# Altium schematic sheet karmanDB_power&pyro.SchDoc
size A
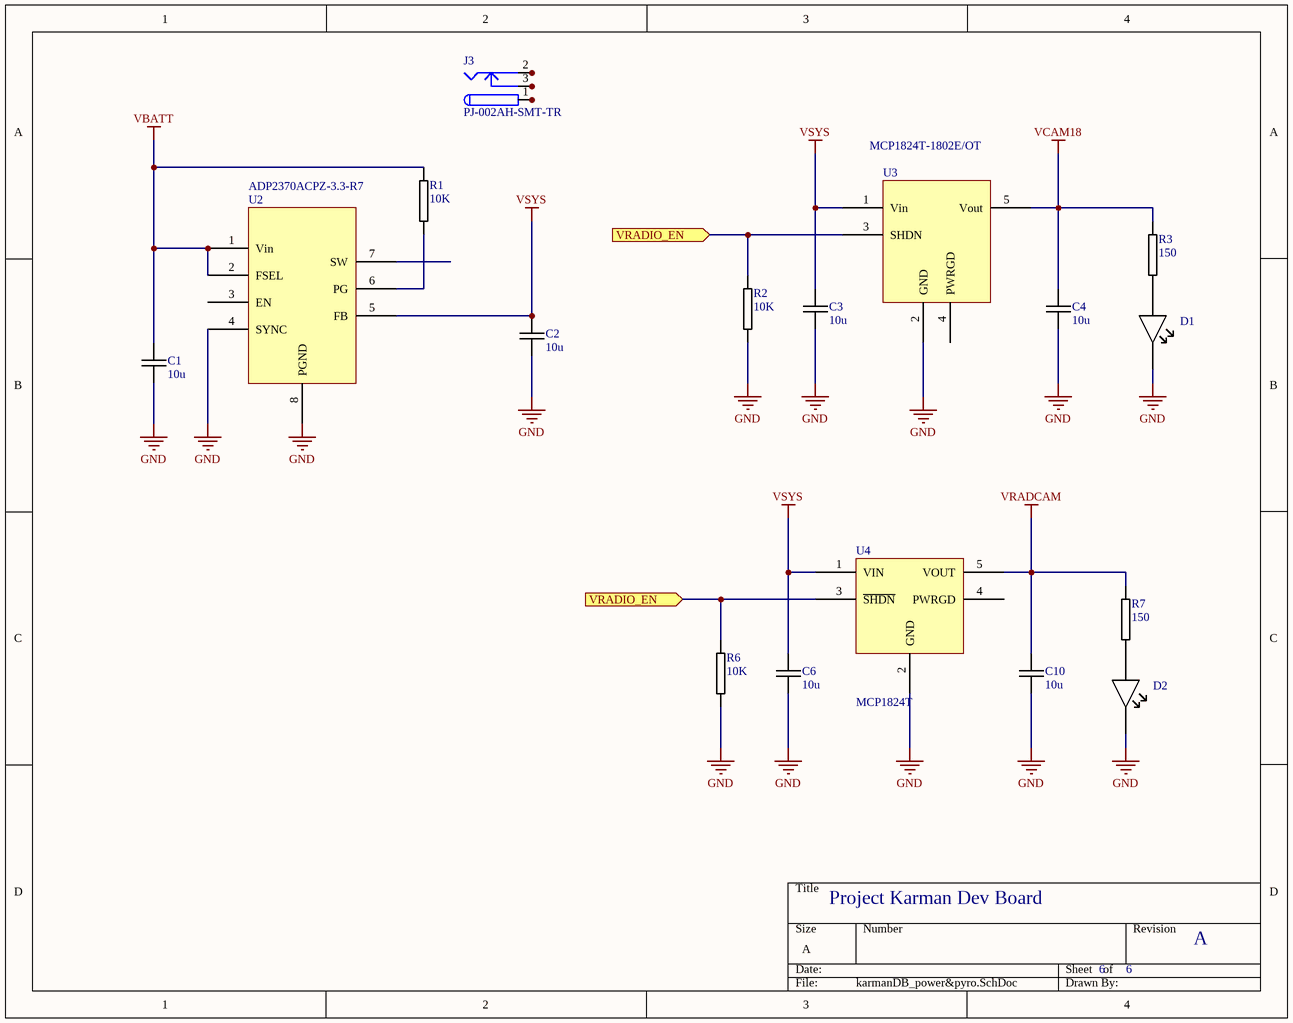
[diagram p0: karmanDB_power&pyro.SchDoc]

## Parts
C1  10u  [MURATA_GRM_0603]
C2  10u  [MURATA_GRM_0603]
C3  10u  [MURATA_GRM_0603]
C4  10u  [MURATA_GRM_0603]
C6  10u  [MURATA_GRM_0603]
C10  10u  [MURATA_GRM_0603]
D1  LED_LITEON_LTST-C150CKT  [LITEON_LTST-C150]  (value not drawn)
D2  LED_LITEON_LTST-C150CKT  [LITEON_LTST-C150]  (value not drawn)
J3  PJ-002AH-SMT-TR
R1  10K  [MURATA_GRM_0603]
R2  10K  [MURATA_GRM_0603]
R3  150  [PANASONIC_ERJ3R]
R6  10K  [MURATA_GRM_0603]
R7  150  [PANASONIC_ERJ3R]
U2  ADP2370ACPZ-3.3-R7
U3  MCP1824T-1802E/OT
U4  MCP1824T  [MICROCHIP_MCP1824/OE]

## Ports
VRADIO_EN (in)

## Nets
GND: C1.2 C2.2 C3.2 C4.2 C6.2 C10.2 D1.K D2.K R2.2 R6.2 U2.4(SYNC) U2.8(PGND) U3.2(GND) U4.2(GND)
VBATT: C1.1 R1.1 U2.1(Vin) U2.2(FSEL)
VCAM18: C4.1 R3.1 U3.5(Vout)
VRADCAM: C10.1 R7.1 U4.5(VOUT)
VSYS: C2.1 C3.1 C6.1 U2.5(FB) U3.1(Vin) U4.1(VIN)
VRADIO_EN: R2.1 R6.1 U3.3(SHDN) U4.3(~{SHDN}) ; port VRADIO_EN
NetD1_A: D1.A R3.2
NetD2_A: D2.A R7.2
NetJ3_1: J3.1 J3.1A J3.1B
NetJ3_2: J3.2 J3.2A J3.2B
NetJ3_3: J3.3 J3.3A J3.3B
NetR1_2: R1.2 U2.6(PG)

Not connected (* = marked no-connect by the designer): U2 3(EN) 7(SW); U3 4(PWRGD); U4 4(PWRGD)

## Notes on the sheet
- Project Karman Dev Board
- 6
- A

## Library data of the parts
C1-C4 C6 C10 = CAP_MURATA_GRM188R60J106: CAP CER 10UF 6.3V 20% X5R 0603; Manufacturer: Murata Electronics North America; Manufacturer Part Number: GRM188R60J106ME47J; Capacitance: 10µF; Supplier 1: Digi-Key; Supplier Part Number 1: 490-6405-1-ND; RoHS: RoHS Compliant; Category: Capacitors; Stock 1: 159118; Pricing: 1=0.19, 10=0.128, 50=0.0776, 100=0.0651, 250=0.05272, 500=0.0465, 1000=0.03953, 5000=0.03333 (USD); Packaging: Cut Tape (CT); Tolerance: ±20%; Voltage - Rated: 6.3V; Temperature Coefficient: X5R; Mounting Type: Surface Mount, MLCC; Operating Temperature: -55°C ~ 85°C; Applications: General Purpose; Ratings: -; Package / Case: 0603 (1608 Metric); Size / Dimension: 0.063" L x 0.031" W (1.60mm x 0.80mm); Height - Seated (Max): -; Thickness (Max): 0.035" (0.90mm); Lead Spacing: -; Features: -; Lead Style: -; ComponentLink1URL: http://www.murata.com/~/media/webrenewal/support/library/catalog/products/capacitor/mlcc/c02e.ashx; ComponentLink1Description: http://www.murata.com/~/media/webrenewal/support/library/catalog/products/capacitor/mlcc/c02e.ashx
D1 D2 = LED_LITEON_LTST-C150CKT: LED RED CLEAR 1206 SMD; Manufacturer: Lite-On Inc; Wavelength - Dominant: 638nm; Wavelength - Peak: 660nm; Millicandela Rating: 10mcd; Voltage - Forward (Vf) (Typ): 1.8V; Current - Test: 10mA; Viewing Angle: 130°; Lens Color: Colorless; Lens Style/Size: Rectangle with Flat Top, 2.06mm x 1.60mm; Supplier 1: Digi-Key; Supplier Part Number 1: 160-1167-1-ND; Manufacturer Part Number: LTST-C150CKT; RoHS: RoHS Compliant; Category: Optoelectronics; Stock 1: 90600; Pricing: 1=0.4, 10=0.297, 100=0.1574, 250=0.11136, 500=0.09504, 1000=0.07425 (USD); Packaging: Cut Tape (CT); Color: Red; Lens Transparency: Clear; Package / Case: 1206 (3216 Metric); Supplier Device Package: 1206; Size / Dimension: 3.20mm L x 1.60mm W; Height (Max): 1.10mm; Mounting Type: Surface Mount; ComponentLink1URL: http://optoelectronics.liteon.com/upload/download/DS-22-98-0002/S_110_LTST-C150CKT.pdf; ComponentLink1Description: http://optoelectronics.liteon.com/upload/download/DS-22-98-0002/S_110_LTST-C150CKT.pdf
J3 = PJ-002AH-SMT-TR: CONN POWER JACK 2.1X5.5MM HI CUR; Manufacturer: CUI Inc.; Gender: Male; Plug/Mating Plug Diameter: 2.1mm ID, 5.5mm OD; Number of Positions/Contacts: 2 Conductors, 3 Contacts; Internal Switch(s): Single Switch, Normally Closed; Shielding: Unshielded; Voltage - Rated: 24VDC; Current Rating: 5A; Supplier 1: Digi-Key; Manufacturer Part Number: PJ-002AH-SMT-TR; RoHS: RoHS Compliant; Category: Connectors, Interconnects; Stock 1: 15720; Pricing 1: 1=1.89, 10=1.469, 100=1.121 (USD); Connector Type: Jack; Mounting Type: Surface Mount; Termination: Solder; Features: -; Color: Black; Contact Material: Copper Alloy; Contact Material - Plating: Nickel; Housing Color: Black; Housing Material: Thermoplastic; Operating Temperature: -25°C ~ 85°C; ComponentLink1URL: http://www.cui.com/product/resource/digikeypdf/pj-002ah-smt.pdf; ComponentLink1Description: http://www.cui.com/product/resource/digikeypdf/pj-002ah-smt.pdf; Supplier Part Number 1: CP-002AHPJCT-ND
R1 R2 R6 = RES_PANASONIC_ERJ-3GEYJ103V: RES SMD 10K OHM 5% 1/10W 0603; Manufacturer: Panasonic Electronic Components; Power (Watts): 0.1W, 1/10W; Temperature Coefficient: ±200ppm/°C; Supplier 1: Digi-Key; Supplier Part Number 1: P10KGCT-ND; Manufacturer Part Number: ERJ-3GEYJ103V; RoHS: RoHS Compliant; Category: Resistors; Stock 1: 4229597; Pricing: 1=0.1, 50=0.0096, 100=0.0071, 250=0.00544, 500=0.00436, 1000=0.00321 (USD); Packaging: Cut Tape (CT); Resistance (Ohms): 10k; Tolerance: ±5%; Composition: Thick Film; Features: Automotive AEC-Q200; Operating Temperature: -55°C ~ 155°C; Package / Case: 0603 (1608 Metric); Supplier Device Package: 0603; Size / Dimension: 0.063" L x 0.031" W (1.60mm x 0.80mm); Height: 0.022" (0.55mm); Number of Terminations: 2; ComponentLink1URL: http://industrial.panasonic.com/www-cgi/jvcr13pz.cgi?E+PZ+3+AOA0001+ERJ3GEYJ103V+7+WW; ComponentLink1Description: http://industrial.panasonic.com/www-cgi/jvcr13pz.cgi?E+PZ+3+AOA0001+ERJ3GEYJ103V+7+WW
R3 R7 = RES_PANASONIC_ERJ-3GEYJ151V: RES SMD 150 OHM 5% 1/10W 0603; Manufacturer: Panasonic Electronic Components; Power (Watts): 0.1W, 1/10W; Temperature Coefficient: ±200ppm/°C; Supplier 1: Digi-Key; Supplier Part Number 1: P150GCT-ND; Manufacturer Part Number: ERJ-3GEYJ151V; RoHS: RoHS Compliant; Category: Resistors; Stock 1: 236723; Pricing: 1=0.1, 50=0.0096, 100=0.0071, 250=0.00544, 500=0.00436, 1000=0.00321 (USD); Packaging: Cut Tape (CT); Resistance (Ohms): 150; Tolerance: ±5%; Composition: Thick Film; Features: Automotive AEC-Q200; Operating Temperature: -55°C ~ 155°C; Package / Case: 0603 (1608 Metric); Supplier Device Package: 0603; Size / Dimension: 0.063" L x 0.031" W (1.60mm x 0.80mm); Height: 0.022" (0.55mm); Number of Terminations: 2; ComponentLink1URL: http://industrial.panasonic.com/www-cgi/jvcr13pz.cgi?E+PZ+3+AOA0001+ERJ3GEYJ151V+7+WW; ComponentLink1Description: http://industrial.panasonic.com/www-cgi/jvcr13pz.cgi?E+PZ+3+AOA0001+ERJ3GEYJ151V+7+WW
U2 = ADP2370ACPZ-3.3-R7: IC REG BCK 3.3V 0.8A SYNC 8LFCSP; Manufacturer: Analog Devices Inc.; Function: Step-Down; Output Configuration: Positive; Topology: Buck; Output Type: Fixed; Number of Outputs: 1; Voltage - Input (Min): 3.2V; Voltage - Input (Max): 15V; Current - Output: 800mA; Frequency - Switching: 600kHz ~ 1.2MHz; Synchronous Rectifier: Yes; Supplier 1: Digi-Key; Manufacturer Part Number: ADP2370ACPZ-3.3-R7; RoHS: RoHS Compliant; Category: Integrated Circuits (ICs); Stock 1: 1716; Pricing 1: 1=3.63, 10=3.259, 100=2.6733, 500=2.2743 (USD); Packaging: Cut Tape (CT); Voltage - Output (Min/Fixed): 3.3V; Voltage - Output (Max): -; Operating Temperature: -40°C ~ 85°C (TA); Mounting Type: Surface Mount; Package / Case: 8-WFDFN Exposed Pad, CSP; Supplier Device Package: 8-LFCSP-WD (3x3); ComponentLink1URL: http://www.analog.com/media/en/technical-documentation/data-sheets/ADP2370_2371.pdf; ComponentLink1Description: http://www.analog.com/media/en/technical-documentation/data-sheets/ADP2370_2371.pdf; Supplier Part Number 1: ADP2370ACPZ-3.3-R7CT-ND
U3 = MCP1824T-1802E/OT: IC REG LDO 1.8V 0.3A SOT23-5; Manufacturer: Microchip Technology; Regulator Topology: Positive Fixed; Current - Output: 300mA; Voltage - Dropout (Typical): 0.2V @ 300mA; Number of Regulators: 1; Voltage - Input: 2.1 V ~ 6 V; Supplier 1: Digi-Key; Manufacturer Part Number: MCP1824T-1802E/OT; RoHS: RoHS Compliant; Category: Integrated Circuits (ICs); Stock 1: 10644; Pricing 1: 1=0.5, 10=0.42, 25=0.35, 100=0.32 (USD); Packaging: Cut Tape (CT); Voltage - Output: 1.8V; Current - Limit (Min): -; Operating Temperature: -40°C ~ 125°C; Mounting Type: Surface Mount; Package / Case: SC-74A, SOT-753; Supplier Device Package: SOT-23-5; ComponentLink1URL: http://www.microchip.com/mymicrochip/filehandler.aspx?ddocname=en533257; ComponentLink1Description: http://www.microchip.com/mymicrochip/filehandler.aspx?ddocname=en533257; Supplier Part Number 1: MCP1824T-1802E/OTCT-ND
U4 = MICROCHIP_MCP1824T-3002E/OT: IC REG LDO 3V 0.3A SOT23-5; Manufacturer: Microchip Technology; Regulator Topology: Positive Fixed; Current - Output: 300mA; Voltage - Dropout (Typical): 0.2V @ 300mA; Number of Regulators: 1; Voltage - Input: Up to 6V; Supplier 1: Digi-Key; Supplier Part Number 1: MCP1824T-3002E/OTCT-ND; Manufacturer Part Number: MCP1824T-3002E/OT; RoHS: RoHS Compliant; Category: Integrated Circuits (ICs); Stock 1: 1253; Pricing: 1=0.5, 10=0.42, 25=0.35, 100=0.32 (USD); Packaging: Cut Tape (CT); Voltage - Output: 3V; Current - Limit (Min): -; Operating Temperature: -40°C ~ 125°C; Mounting Type: Surface Mount; Package / Case: SC-74A, SOT-753; Supplier Device Package: SOT-23-5; ComponentLink1URL: http://www.microchip.com/mymicrochip/filehandler.aspx?ddocname=en533257; ComponentLink1Description: http://www.microchip.com/mymicrochip/filehandler.aspx?ddocname=en533257